# Altium project Ryuji_8x8.PrjPcb
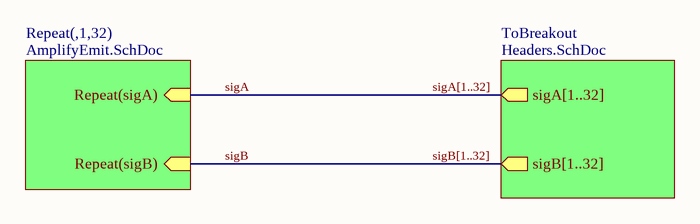
[diagram p0: ArrayBoardTop.SchDoc]
3 sheets, 132 parts. Net scope: hierarchical (ports join the sheet entries above them; power ports are global).
Board file: ArrayBoard.PcbDoc
Sheets:
  ArrayBoardTop.SchDoc
    1 = AmplifyEmit.SchDoc
    2 = AmplifyEmit.SchDoc
    3 = AmplifyEmit.SchDoc
    4 = AmplifyEmit.SchDoc
    5 = AmplifyEmit.SchDoc
    6 = AmplifyEmit.SchDoc
    7 = AmplifyEmit.SchDoc
    8 = AmplifyEmit.SchDoc
    9 = AmplifyEmit.SchDoc
    10 = AmplifyEmit.SchDoc
    11 = AmplifyEmit.SchDoc
    12 = AmplifyEmit.SchDoc
    13 = AmplifyEmit.SchDoc
    14 = AmplifyEmit.SchDoc
    15 = AmplifyEmit.SchDoc
    16 = AmplifyEmit.SchDoc
    17 = AmplifyEmit.SchDoc
    18 = AmplifyEmit.SchDoc
    19 = AmplifyEmit.SchDoc
    20 = AmplifyEmit.SchDoc
    21 = AmplifyEmit.SchDoc
    22 = AmplifyEmit.SchDoc
    23 = AmplifyEmit.SchDoc
    24 = AmplifyEmit.SchDoc
    25 = AmplifyEmit.SchDoc
    26 = AmplifyEmit.SchDoc
    27 = AmplifyEmit.SchDoc
    28 = AmplifyEmit.SchDoc
    29 = AmplifyEmit.SchDoc
    30 = AmplifyEmit.SchDoc
    31 = AmplifyEmit.SchDoc
    32 = AmplifyEmit.SchDoc
    ToBreakout = Headers.SchDoc

## Sheet ArrayBoardTop.SchDoc
size A4; SheetNumber: 1; SheetTotal: 3

### Sub-sheets
Repeat(,1,32) = AmplifyEmit.SchDoc: Repeat(sigB) (in), Repeat(sigA) (in)
ToBreakout = Headers.SchDoc: sigB[1..32] (out), sigA[1..32] (out)

### Nets
sigA: sheet Repeat(,1,32)/Repeat(sigA)
sigB: sheet Repeat(,1,32)/Repeat(sigB)

### Buses and harness runs
bus sigA[1..32] = sheet ToBreakout/sigA[1..32]
bus sigB[1..32] = sheet ToBreakout/sigB[1..32]

## Sheet AmplifyEmit.SchDoc
size A4; SheetNumber: 2; SheetTotal: 3
Used 32 times, as channels 1, 2, 3, 4, 5, 6, 7, 8, 9, 10, 11, 12, 13, 14, 15, 16, 17, 18, 19, 20, 21, 22, 23, 24, 25, 26, 27, 28, 29, 30, 31, 32. Parts and nets are listed once, with the designators drawn on the sheet.
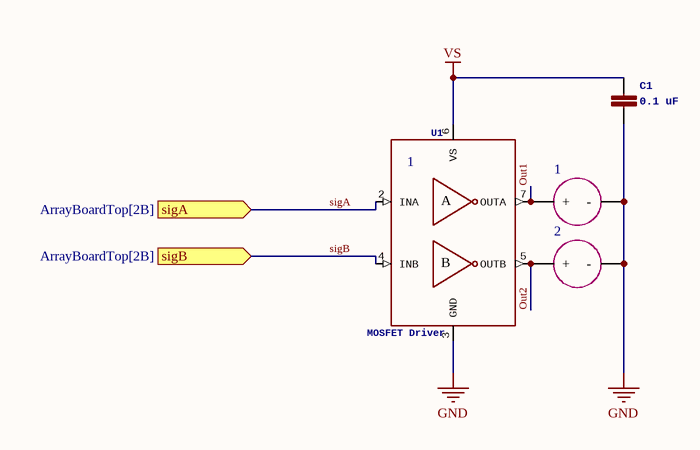
[diagram p1: AmplifyEmit.SchDoc]

### Parts
1  EMIT  [TRANSDUCER]  (value not drawn)
2  EMIT  [TRANSDUCER]  (value not drawn)
C1  0.1 uF  [CAP0805 - CERAMIC]
U1  MOSFET Driver  [MIC4127YME]

### Ports
sigA (in, see ArrayBoardTop[2B]), sigB (in, see ArrayBoardTop[2B])

### Nets
GND: 1.- 2.- C1.2 U1.3(GND)
VS: C1.1 U1.6(VS)
Out1: 1.+ U1.7(OUTA)
Out2: 2.+ U1.5(OUTB)
sigA: U1.2(INA) ; port sigA
sigB: U1.4(INB) ; port sigB

### Channels
1: designators 1=58 2=57 C1=C1.1 U1=U1.1; ports sigA=sigA sigB=sigB
2: designators 1=60 2=59 C1=C1.2 U1=U1.2; ports sigA=sigA sigB=sigB
3: designators 1=62 2=61 C1=C1.3 U1=U1.3; ports sigA=sigA sigB=sigB
4: designators 1=64 2=63 C1=C1.4 U1=U1.4; ports sigA=sigA sigB=sigB
5: designators 1=50 2=49 C1=C1.5 U1=U1.5; ports sigA=sigA sigB=sigB
6: designators 1=52 2=51 C1=C1.6 U1=U1.6; ports sigA=sigA sigB=sigB
7: designators 1=54 2=53 C1=C1.7 U1=U1.7; ports sigA=sigA sigB=sigB
8: designators 1=56 2=55 C1=C1.8 U1=U1.8; ports sigA=sigA sigB=sigB
9: designators 1=42 2=41 C1=C1.9 U1=U1.9; ports sigA=sigA sigB=sigB
10: designators 1=44 2=43 C1=C1.10 U1=U1.10; ports sigA=sigA sigB=sigB
11: designators 1=46 2=45 C1=C1.11 U1=U1.11; ports sigA=sigA sigB=sigB
12: designators 1=48 2=47 C1=C1.12 U1=U1.12; ports sigA=sigA sigB=sigB
13: designators 1=34 2=33 C1=C1.13 U1=U1.13; ports sigA=sigA sigB=sigB
14: designators 1=36 2=35 C1=C1.14 U1=U1.14; ports sigA=sigA sigB=sigB
15: designators 1=38 2=37 C1=C1.15 U1=U1.15; ports sigA=sigA sigB=sigB
16: designators 1=40 2=39 C1=C1.16 U1=U1.16; ports sigA=sigA sigB=sigB
17: designators 1=26 2=25 C1=C1.17 U1=U1.17; ports sigA=sigA sigB=sigB
18: designators 1=28 2=27 C1=C1.18 U1=U1.18; ports sigA=sigA sigB=sigB
19: designators 1=30 2=29 C1=C1.19 U1=U1.19; ports sigA=sigA sigB=sigB
20: designators 1=32 2=31 C1=C1.20 U1=U1.20; ports sigA=sigA sigB=sigB
21: designators 1=18 2=17 C1=C1.21 U1=U1.21; ports sigA=sigA sigB=sigB
22: designators 1=20 2=19 C1=C1.22 U1=U1.22; ports sigA=sigA sigB=sigB
23: designators 1=22 2=21 C1=C1.23 U1=U1.23; ports sigA=sigA sigB=sigB
24: designators 1=24 2=23 C1=C1.24 U1=U1.24; ports sigA=sigA sigB=sigB
25: designators 1=10 2=9 C1=C1.25 U1=U1.25; ports sigA=sigA sigB=sigB
26: designators 1=12 2=11 C1=C1.26 U1=U1.26; ports sigA=sigA sigB=sigB
27: designators 1=14 2=13 C1=C1.27 U1=U1.27; ports sigA=sigA sigB=sigB
28: designators 1=16 2=15 C1=C1.28 U1=U1.28; ports sigA=sigA sigB=sigB
29: designators 1=2 2=1 C1=C1.29 U1=U1.29; ports sigA=sigA sigB=sigB
30: designators 1=4 2=3 C1=C1.30 U1=U1.30; ports sigA=sigA sigB=sigB
31: designators 1=6 2=5 C1=C1.31 U1=U1.31; ports sigA=sigA sigB=sigB
32: designators 1=8 2=7 C1=C1.32 U1=U1.32; ports sigA=sigA sigB=sigB

### Notes on the sheet
- (near U1) 1
- (in symbol MIC4127) A; B

### Library data of the parts
C1 = CAP CERAMIC
U1 = MIC4127

## Sheet Headers.SchDoc
size A4; SheetNumber: 3; SheetTotal: 3
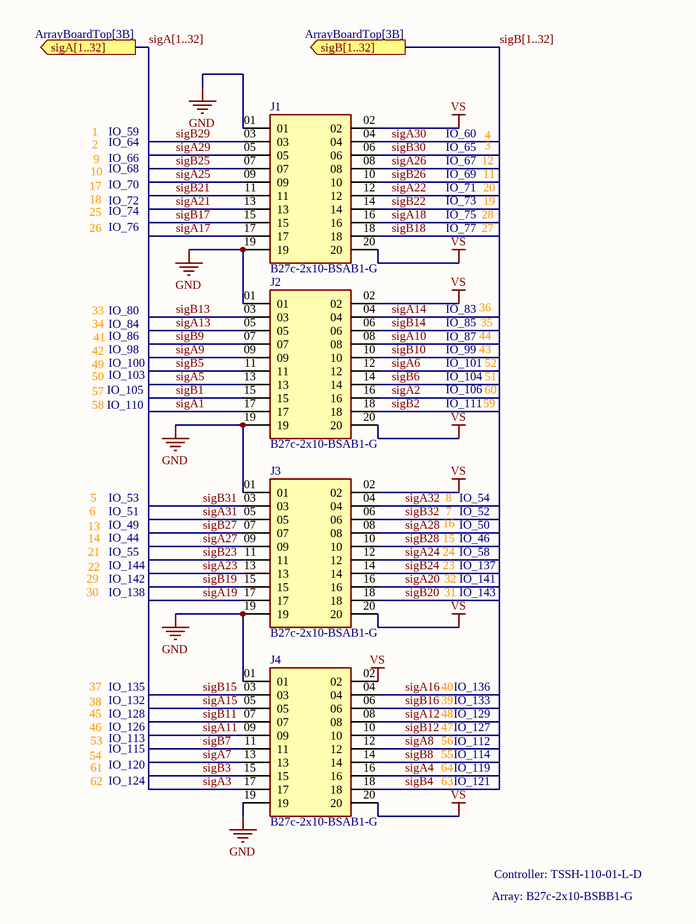
[diagram p2: Headers.SchDoc]

### Parts
J1  B27c-2x10-BSAB1-G  [B27C SMT2x10]
J2  B27c-2x10-BSAB1-G  [B27C SMT2x10]
J3  B27c-2x10-BSAB1-G  [B27C SMT2x10]
J4  B27c-2x10-BSAB1-G  [B27C SMT2x10]

### Ports
sigA[1..32] (out, see ArrayBoardTop[3B]), sigB[1..32] (out, see ArrayBoardTop[3B])

### Nets
GND: J1.01 J1.19 J2.01 J2.19 J3.01 J3.19 J4.01 J4.19
VS: J1.02 J1.20 J2.02 J2.20 J3.02 J3.20 J4.02 J4.20
sigA1: J2.17  [project net sigA]
sigA2: J2.16  [project net sigA]
sigA3: J4.17  [project net sigA]
sigA4: J4.16  [project net sigA]
sigA5: J2.13  [project net sigA]
sigA6: J2.12  [project net sigA]
sigA7: J4.13  [project net sigA]
sigA8: J4.12  [project net sigA]
sigA9: J2.09  [project net sigA]
sigA10: J2.08  [project net sigA]
sigA11: J4.09  [project net sigA]
sigA12: J4.08  [project net sigA]
sigA13: J2.05  [project net sigA]
sigA14: J2.04  [project net sigA]
sigA15: J4.05  [project net sigA]
sigA16: J4.04  [project net sigA]
sigA17: J1.17  [project net sigA]
sigA18: J1.16  [project net sigA]
sigA19: J3.17  [project net sigA]
sigA20: J3.16  [project net sigA]
sigA21: J1.13  [project net sigA]
sigA22: J1.12  [project net sigA]
sigA23: J3.13  [project net sigA]
sigA24: J3.12  [project net sigA]
sigA25: J1.09  [project net sigA]
sigA26: J1.08  [project net sigA]
sigA27: J3.09  [project net sigA]
sigA28: J3.08  [project net sigA]
sigA29: J1.05  [project net sigA]
sigA30: J1.04  [project net sigA]
sigA31: J3.05  [project net sigA]
sigA32: J3.04  [project net sigA]
sigB1: J2.15  [project net sigB]
sigB2: J2.18  [project net sigB]
sigB3: J4.15  [project net sigB]
sigB4: J4.18  [project net sigB]
sigB5: J2.11  [project net sigB]
sigB6: J2.14  [project net sigB]
sigB7: J4.11  [project net sigB]
sigB8: J4.14  [project net sigB]
sigB9: J2.07  [project net sigB]
sigB10: J2.10  [project net sigB]
sigB11: J4.07  [project net sigB]
sigB12: J4.10  [project net sigB]
sigB13: J2.03  [project net sigB]
sigB14: J2.06  [project net sigB]
sigB15: J4.03  [project net sigB]
sigB16: J4.06  [project net sigB]
sigB17: J1.15  [project net sigB]
sigB18: J1.18  [project net sigB]
sigB19: J3.15  [project net sigB]
sigB20: J3.18  [project net sigB]
sigB21: J1.11  [project net sigB]
sigB22: J1.14  [project net sigB]
sigB23: J3.11  [project net sigB]
sigB24: J3.14  [project net sigB]
sigB25: J1.07  [project net sigB]
sigB26: J1.10  [project net sigB]
sigB27: J3.07  [project net sigB]
sigB28: J3.10  [project net sigB]
sigB29: J1.03  [project net sigB]
sigB30: J1.06  [project net sigB]
sigB31: J3.03  [project net sigB]
sigB32: J3.06  [project net sigB]

### Buses and harness runs
bus sigA[1..32] = port sigA[1..32]
bus sigB[1..32] = port sigB[1..32]

### Notes on the sheet
- 10
- 1
- 2
- 9
- IO_59
- IO_64
- IO_66
- IO_68
- IO_60
- IO_65
- IO_67
- IO_69
- 12
- 11
- 3
- 4
- 17
- 18
- 25
- 26
- IO_70
- IO_72
- IO_74
- IO_76
- IO_71
- IO_75
- IO_77
- IO_73
- 27
- 28
- 19
- 20
- 33
- IO_80
- IO_83
- 36
- 34
- 42
- 49
- 50
- 41
- IO_84
- IO_86
- IO_98
- IO_100
- IO_103
- IO_85
- IO_99
- IO_104
- IO_87
- IO_101
- 43
- 44
- 35
- 51
- 52
- 57
- 58
- IO_105
- IO_110
- IO_111
- IO_106
- 59
- 60
- 6
- 5
- IO_53
- IO_51
- 7
- 8
- IO_54
- IO_52
- 29
- 13
- 14
- 21
- 22
- IO_49
- IO_55
- IO_142
- IO_144
- IO_44
- 15
- 16
- 23
- 24
- 32
- IO_46
- IO_50
- IO_58
- IO_137
- IO_141
- 30
- IO_138
- 31
- IO_143
- 37
- 38
- 45
- IO_128
- IO_132
- IO_135
- 39
- 40
- 48
- IO_129
- IO_133
- IO_136
- 46
- 54
- 53
- 61
- 62
- IO_126
- IO_113
- IO_115
- IO_120
- IO_124
- 47
- 55
- 56
- 63
- 64
- IO_127
- IO_114
- IO_121
- IO_112
- IO_119
- Array: B27c-2x10-BSBB1-G
- Controller: TSSH-110-01-L-D

### Library data of the parts
J1-J4 = B27c-2x10-BSAB1-G: System: Connector; Price: None; Availability: Unavailable; MP: B27c-2x10-BSAB1-G; Package: None

## Nets that join several sheets
GND: 1 (57.- 58.- C1.1.2 U1.1.3), 2 (59.- 60.- C1.2.2 U1.2.3), 3 (61.- 62.- C1.3.2 U1.3.3), 4 (63.- 64.- C1.4.2 U1.4.3), 5 (49.- 50.- C1.5.2 U1.5.3), 6 (51.- 52.- C1.6.2 U1.6.3), 7 (53.- 54.- C1.7.2 U1.7.3), 8 (55.- 56.- C1.8.2 U1.8.3), 9 (41.- 42.- C1.9.2 U1.9.3), 10 (43.- 44.- C1.10.2 U1.10.3), 11 (45.- 46.- C1.11.2 U1.11.3), 12 (47.- 48.- C1.12.2 U1.12.3), 13 (33.- 34.- C1.13.2 U1.13.3), 14 (35.- 36.- C1.14.2 U1.14.3), 15 (37.- 38.- C1.15.2 U1.15.3), 16 (39.- 40.- C1.16.2 U1.16.3), 17 (25.- 26.- C1.17.2 U1.17.3), 18 (27.- 28.- C1.18.2 U1.18.3), 19 (29.- 30.- C1.19.2 U1.19.3), 20 (31.- 32.- C1.20.2 U1.20.3), 21 (17.- 18.- C1.21.2 U1.21.3), 22 (19.- 20.- C1.22.2 U1.22.3), 23 (21.- 22.- C1.23.2 U1.23.3), 24 (23.- 24.- C1.24.2 U1.24.3), 25 (9.- 10.- C1.25.2 U1.25.3), 26 (11.- 12.- C1.26.2 U1.26.3), 27 (13.- 14.- C1.27.2 U1.27.3), 28 (15.- 16.- C1.28.2 U1.28.3), 29 (1.- 2.- C1.29.2 U1.29.3), 30 (3.- 4.- C1.30.2 U1.30.3), 31 (5.- 6.- C1.31.2 U1.31.3), 32 (7.- 8.- C1.32.2 U1.32.3), Headers (8 pins)
VS: 1 (C1.1.1 U1.1.6), 2 (C1.2.1 U1.2.6), 3 (C1.3.1 U1.3.6), 4 (C1.4.1 U1.4.6), 5 (C1.5.1 U1.5.6), 6 (C1.6.1 U1.6.6), 7 (C1.7.1 U1.7.6), 8 (C1.8.1 U1.8.6), 9 (C1.9.1 U1.9.6), 10 (C1.10.1 U1.10.6), 11 (C1.11.1 U1.11.6), 12 (C1.12.1 U1.12.6), 13 (C1.13.1 U1.13.6), 14 (C1.14.1 U1.14.6), 15 (C1.15.1 U1.15.6), 16 (C1.16.1 U1.16.6), 17 (C1.17.1 U1.17.6), 18 (C1.18.1 U1.18.6), 19 (C1.19.1 U1.19.6), 20 (C1.20.1 U1.20.6), 21 (C1.21.1 U1.21.6), 22 (C1.22.1 U1.22.6), 23 (C1.23.1 U1.23.6), 24 (C1.24.1 U1.24.6), 25 (C1.25.1 U1.25.6), 26 (C1.26.1 U1.26.6), 27 (C1.27.1 U1.27.6), 28 (C1.28.1 U1.28.6), 29 (C1.29.1 U1.29.6), 30 (C1.30.1 U1.30.6), 31 (C1.31.1 U1.31.6), 32 (C1.32.1 U1.32.6), Headers (8 pins)
sigA: 1 (U1.1.2), Headers (J2.17)
sigA: 2 (U1.2.2), Headers (J2.16)
sigA: 3 (U1.3.2), Headers (J4.17)
sigA: 4 (U1.4.2), Headers (J4.16)
sigA: 5 (U1.5.2), Headers (J2.13)
sigA: 6 (U1.6.2), Headers (J2.12)
sigA: 7 (U1.7.2), Headers (J4.13)
sigA: 8 (U1.8.2), Headers (J4.12)
sigA: 9 (U1.9.2), Headers (J2.09)
sigA: 10 (U1.10.2), Headers (J2.08)
sigA: 11 (U1.11.2), Headers (J4.09)
sigA: 12 (U1.12.2), Headers (J4.08)
sigA: 13 (U1.13.2), Headers (J2.05)
sigA: 14 (U1.14.2), Headers (J2.04)
sigA: 15 (U1.15.2), Headers (J4.05)
sigA: 16 (U1.16.2), Headers (J4.04)
sigA: 17 (U1.17.2), Headers (J1.17)
sigA: 18 (U1.18.2), Headers (J1.16)
sigA: 19 (U1.19.2), Headers (J3.17)
sigA: 20 (U1.20.2), Headers (J3.16)
sigA: 21 (U1.21.2), Headers (J1.13)
sigA: 22 (U1.22.2), Headers (J1.12)
sigA: 23 (U1.23.2), Headers (J3.13)
sigA: 24 (U1.24.2), Headers (J3.12)
sigA: 25 (U1.25.2), Headers (J1.09)
sigA: 26 (U1.26.2), Headers (J1.08)
sigA: 27 (U1.27.2), Headers (J3.09)
sigA: 28 (U1.28.2), Headers (J3.08)
sigA: 29 (U1.29.2), Headers (J1.05)
sigA: 30 (U1.30.2), Headers (J1.04)
sigA: 31 (U1.31.2), Headers (J3.05)
sigA: 32 (U1.32.2), Headers (J3.04)
sigB: 1 (U1.1.4), Headers (J2.15)
sigB: 2 (U1.2.4), Headers (J2.18)
sigB: 3 (U1.3.4), Headers (J4.15)
sigB: 4 (U1.4.4), Headers (J4.18)
sigB: 5 (U1.5.4), Headers (J2.11)
sigB: 6 (U1.6.4), Headers (J2.14)
sigB: 7 (U1.7.4), Headers (J4.11)
sigB: 8 (U1.8.4), Headers (J4.14)
sigB: 9 (U1.9.4), Headers (J2.07)
sigB: 10 (U1.10.4), Headers (J2.10)
sigB: 11 (U1.11.4), Headers (J4.07)
sigB: 12 (U1.12.4), Headers (J4.10)
sigB: 13 (U1.13.4), Headers (J2.03)
sigB: 14 (U1.14.4), Headers (J2.06)
sigB: 15 (U1.15.4), Headers (J4.03)
sigB: 16 (U1.16.4), Headers (J4.06)
sigB: 17 (U1.17.4), Headers (J1.15)
sigB: 18 (U1.18.4), Headers (J1.18)
sigB: 19 (U1.19.4), Headers (J3.15)
sigB: 20 (U1.20.4), Headers (J3.18)
sigB: 21 (U1.21.4), Headers (J1.11)
sigB: 22 (U1.22.4), Headers (J1.14)
sigB: 23 (U1.23.4), Headers (J3.11)
sigB: 24 (U1.24.4), Headers (J3.14)
sigB: 25 (U1.25.4), Headers (J1.07)
sigB: 26 (U1.26.4), Headers (J1.10)
sigB: 27 (U1.27.4), Headers (J3.07)
sigB: 28 (U1.28.4), Headers (J3.10)
sigB: 29 (U1.29.4), Headers (J1.03)
sigB: 30 (U1.30.4), Headers (J1.06)
sigB: 31 (U1.31.4), Headers (J3.03)
sigB: 32 (U1.32.4), Headers (J3.06)